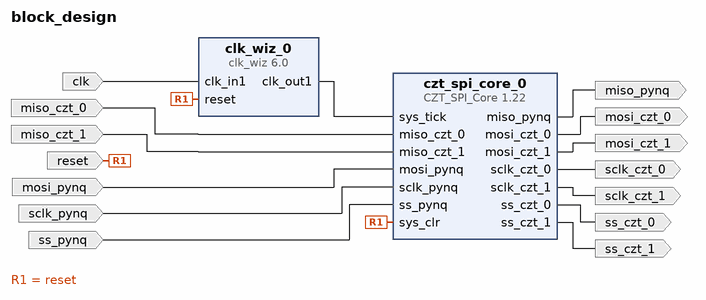
[diagram p0: block diagram of the top level]
# Vivado block design block_design, xc7a35tcpg236-1, Vivado 2022.1
create_bd_design block_design

create_bd_port -dir I miso_czt_0
create_bd_port -dir O mosi_czt_0
create_bd_port -dir O sclk_czt_0
create_bd_port -dir O ss_czt_0
create_bd_port -dir I miso_czt_1
create_bd_port -dir O mosi_czt_1
create_bd_port -dir O sclk_czt_1
create_bd_port -dir O ss_czt_1
create_bd_port -dir O miso_pynq
create_bd_port -dir I mosi_pynq
create_bd_port -dir I sclk_pynq
create_bd_port -dir I ss_pynq
create_bd_port -dir I clk
create_bd_port -dir I reset

create_bd_cell -type ip -vlnv xilinx.com:ip:clk_wiz:6.0 clk_wiz_0
set_property -dict [list \
  CONFIG.CLKOUT1_REQUESTED_OUT_FREQ 120.0 \
  CONFIG.PRIM_IN_FREQ 12.0 \
  CONFIG.PRIM_SOURCE Single_ended_clock_capable_pin \
] [get_bd_cells clk_wiz_0]
create_bd_cell -type ip -vlnv user:user:CZT_SPI_Core:1.22 czt_spi_core_0
set_property -dict {CONFIG.czt_spi_clk_ratio 3} [get_bd_cells czt_spi_core_0]

# ---- connections ----

connect_bd_net [get_bd_ports clk] [get_bd_pins clk_wiz_0/clk_in1]
connect_bd_net [get_bd_pins clk_wiz_0/clk_out1] [get_bd_pins czt_spi_core_0/sys_tick]
connect_bd_net [get_bd_pins czt_spi_core_0/miso_pynq] [get_bd_ports miso_pynq]
connect_bd_net [get_bd_pins czt_spi_core_0/mosi_czt_0] [get_bd_ports mosi_czt_0]
connect_bd_net [get_bd_pins czt_spi_core_0/mosi_czt_1] [get_bd_ports mosi_czt_1]
connect_bd_net [get_bd_pins czt_spi_core_0/sclk_czt_0] [get_bd_ports sclk_czt_0]
connect_bd_net [get_bd_pins czt_spi_core_0/sclk_czt_1] [get_bd_ports sclk_czt_1]
connect_bd_net [get_bd_pins czt_spi_core_0/ss_czt_0] [get_bd_ports ss_czt_0]
connect_bd_net [get_bd_pins czt_spi_core_0/ss_czt_1] [get_bd_ports ss_czt_1]
connect_bd_net -net miso_czt_0_1 [get_bd_ports miso_czt_0] [get_bd_pins czt_spi_core_0/miso_czt_0]
connect_bd_net -net miso_czt_1_1 [get_bd_ports miso_czt_1] [get_bd_pins czt_spi_core_0/miso_czt_1]
connect_bd_net [get_bd_ports mosi_pynq] [get_bd_pins czt_spi_core_0/mosi_pynq]
connect_bd_net [get_bd_ports reset] [get_bd_pins clk_wiz_0/reset] [get_bd_pins czt_spi_core_0/sys_clr]
connect_bd_net [get_bd_ports sclk_pynq] [get_bd_pins czt_spi_core_0/sclk_pynq]
connect_bd_net [get_bd_ports ss_pynq] [get_bd_pins czt_spi_core_0/ss_pynq]

validate_bd_design
save_bd_design
